# Altium schematic sheet power_stage.SchDoc
size Letter
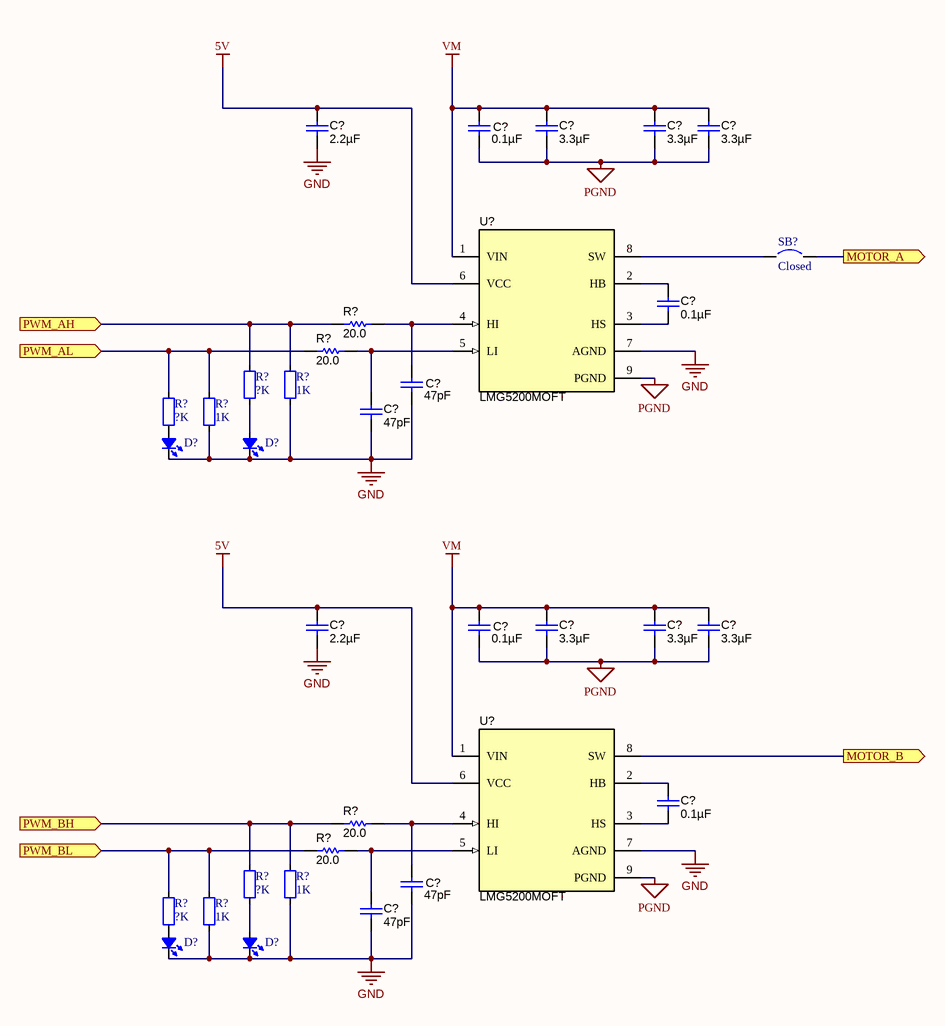
[diagram p0: power_stage.SchDoc]

## Parts
(Parts that share a designator on the sheet are numbered #1, #2 ... from top to bottom, then left to right.)
C?#1  ValueDisplayed: 0.1µF  [1206_190]  (hidden comment: C3216C0G2A104J160AC)
C?#2  ValueDisplayed: 2.2µF  [0402]  (hidden comment: C1005X5R1A225K050BC)
C?#3  ValueDisplayed: 3.3µF  [1206_190]  (hidden comment: C3216X7S2A335M160AB)
C?#4  ValueDisplayed: 3.3µF  [1206_190]  (hidden comment: C3216X7S2A335M160AB)
C?#5  ValueDisplayed: 3.3µF  [1206_190]  (hidden comment: C3216X7S2A335M160AB)
C?#6  ValueDisplayed: 0.1µF  [0402]  (hidden comment: GCM155R71C104KA55D)
C?#7  ValueDisplayed: 47pF  [0402]  (hidden comment: GRM1555C1E470JA01D)
C?#8  ValueDisplayed: 47pF  [0402]  (hidden comment: GRM1555C1E470JA01D)
C?#9  ValueDisplayed: 0.1µF  [1206_190]  (hidden comment: C3216C0G2A104J160AC)
C?#10  ValueDisplayed: 2.2µF  [0402]  (hidden comment: C1005X5R1A225K050BC)
C?#11  ValueDisplayed: 3.3µF  [1206_190]  (hidden comment: C3216X7S2A335M160AB)
C?#12  ValueDisplayed: 3.3µF  [1206_190]  (hidden comment: C3216X7S2A335M160AB)
C?#13  ValueDisplayed: 3.3µF  [1206_190]  (hidden comment: C3216X7S2A335M160AB)
C?#14  ValueDisplayed: 0.1µF  [0402]  (hidden comment: GCM155R71C104KA55D)
C?#15  ValueDisplayed: 47pF  [0402]  (hidden comment: GRM1555C1E470JA01D)
C?#16  ValueDisplayed: 47pF  [0402]  (hidden comment: GRM1555C1E470JA01D)
D?#1  LED_0402  [LED_0402_RED]  (value not drawn)
D?#2  LED_0402  [LED_0402_RED]  (value not drawn)
D?#3  LED_0402  [LED_0402_RED]  (value not drawn)
D?#4  LED_0402  [LED_0402_RED]  (value not drawn)
R?#1  ValueDisplayed: 20.0  [0402]  (hidden comment: CRCW040220R0FKED)
R?#2  ValueDisplayed: 20.0  [0402]  (hidden comment: CRCW040220R0FKED)
R?#3  value ?K  [RES_0402]  (hidden comment: Res_0402)
R?#4  value 1K  [RES_0805]  (hidden comment: Res_0805)
R?#5  value ?K  [RES_0402]  (hidden comment: Res_0402)
R?#6  value 1K  [RES_0805]  (hidden comment: Res_0805)
R?#7  ValueDisplayed: 20.0  [0402]  (hidden comment: CRCW040220R0FKED)
R?#8  ValueDisplayed: 20.0  [0402]  (hidden comment: CRCW040220R0FKED)
R?#9  value ?K  [RES_0402]  (hidden comment: Res_0402)
R?#10  value 1K  [RES_0805]  (hidden comment: Res_0805)
R?#11  value ?K  [RES_0402]  (hidden comment: Res_0402)
R?#12  value 1K  [RES_0805]  (hidden comment: Res_0805)
SB?  Closed  [SB_0603]
U?#1  LMG5200MOFT  [MOF0009A]
U?#2  LMG5200MOFT  [MOF0009A]

## Ports
MOTOR_A (out), MOTOR_B (out), PWM_AH (in), PWM_AL (in), PWM_BH (in), PWM_BL (in)

## Nets
5V: C?#2.1 C?#10.1 U?#1.6(VCC) U?#2.6(VCC)
GND: C?#2.2 C?#7.2 C?#8.2 C?#10.2 C?#15.2 C?#16.2 D?#1.2(K) D?#2.2(K) D?#3.2(K) D?#4.2(K) R?#4.1 R?#6.1 R?#10.1 R?#12.1 U?#1.7(AGND) U?#2.7(AGND)
PGND: C?#1.1 C?#3.2 C?#4.2 C?#5.2 C?#9.1 C?#11.2 C?#12.2 C?#13.2 U?#1.9(PGND) U?#2.9(PGND)
VM: C?#1.2 C?#3.1 C?#4.1 C?#5.1 C?#9.2 C?#11.1 C?#12.1 C?#13.1 U?#1.1(VIN) U?#2.1(VIN)
MOTOR_A: SB?.2 ; port MOTOR_A
MOTOR_B: U?#2.8(SW) ; port MOTOR_B
PWM_AH: R?#1.2 R?#3.2 R?#4.2 ; port PWM_AH
PWM_AL: R?#2.2 R?#5.2 R?#6.2 ; port PWM_AL
PWM_BH: R?#7.2 R?#9.2 R?#10.2 ; port PWM_BH
PWM_BL: R?#8.2 R?#11.2 R?#12.2 ; port PWM_BL
NetC?#6_1: C?#6.1 U?#1.2(HB)
NetC?#6_2: C?#6.2 U?#1.3(HS)
NetC?#7_1: C?#7.1 R?#1.1 U?#1.4(HI)
NetC?#8_1: C?#8.1 R?#2.1 U?#1.5(LI)
NetC?#14_1: C?#14.1 U?#2.2(HB)
NetC?#14_2: C?#14.2 U?#2.3(HS)
NetC?#15_1: C?#15.1 R?#7.1 U?#2.4(HI)
NetC?#16_1: C?#16.1 R?#8.1 U?#2.5(LI)
NetD?#1_1: D?#1.1(A) R?#5.1
NetD?#2_1: D?#2.1(A) R?#3.1
NetD?#3_1: D?#3.1(A) R?#11.1
NetD?#4_1: D?#4.1(A) R?#9.1
NetSB?_1: SB?.1 U?#1.8(SW)

## Library data of the parts
C?#1 C?#9 = C3216C0G2A104J160AC: CAP, CERM, 0.1 µF, 100 V, +/- 5%, C0G/NP0, 1206_190; Manufacturer: TDK; Polarized: N; CompType: Capacitor; Value: 0.1uF; U/M: EA; Cap_F: 0.0000001; Tolerance_%: 5; Value1: Unknown; VDC_V: 100; Value2: 100V; TaMin_C: -55; TaMax_C: 125; Cap_Case: 1206; SizeArea_mm2: 5.12; SizeAreaWB_mm2: 10.92; SizeX_mm: 3.2; SizeY_mm: 1.6; SizeZ_mm: 1.9; AEC Category: Q200; SymbolVersion: 2008-07-09; PartNumber: C3216C0G2A104J160AC; PackageReference: 1206_190; RoHS: Y; MountType: SMT; Technology: Ceramic; TempCo: C0G/NP0; Published: 2008-06-19; Publisher: Texas Instruments; LatestRevisionDate: 2016-07-21; ComponentLink1Description: Datasheet link; ComponentLink1URL: http://product.tdk.com/en/catalog/spec/mlccspec_commercial_general_midvoltage_en.pdf; Supplier 1: Digi-Key; Supplier Part Number 1: 445-172677-6-ND; Supplier 2: Mouser; Supplier Part Number 2: 810-C3216C0G2A104J6C; Supplier 3: Newark; Supplier Part Number 3: 39Y4271; AEC Qualified: N; AEC Grade: N/A
C?#2 C?#10 = C1005X5R1A225K050BC: CAP, CERM, 2.2 µF, 10 V, +/- 10%, X5R, 0402; Manufacturer: TDK; Polarized: N; CompType: Capacitor; Value: 2.2uF; U/M: EA; Cap_F: 0.0000022; Tolerance_%: 10; Value1: Unknown; Value2: 10V; TaMin_C: -55; TaMax_C: 85; SizeArea_mm2: 0.5; SizeAreaWB_mm2: 3; SizeX_mm: 1; SizeZ_mm: 0.6; AEC Category: Q200; SymbolVersion: 2008-07-09; PartNumber: C1005X5R1A225K050BC; PackageReference: 0402; RoHS: Y; VDC_V: 10; MountType: SMT; Technology: Ceramic; TempCo: X5R; Cap_Case: 0402; SizeY_mm: 0.5; Published: 2008-06-19; Publisher: Texas Instruments; LatestRevisionDate: 2016-06-02; ComponentLink1Description: Datasheet link; ComponentLink1URL: http://product.tdk.com/en/catalog/datasheets/mlcc_commercial_general_en.pdf; Supplier 1: Digi-Key; Supplier Part Number 1: 445-7392-1-ND; Supplier 2: Newark; Supplier Part Number 2: 87R3267; AEC Qualified: N; AEC Grade: N/A
C?#3-C?#5 C?#11-C?#13 = C3216X7S2A335M160AB: CAP, CERM, 3.3 µF, 100 V, +/- 20%, X7S, 1206_190; Manufacturer: TDK; Polarized: N; CompType: Capacitor; Value: 3.3uF; U/M: EA; Cap_F: 0.0000033; Tolerance_%: 20; ESR_ohm: 0.003048; Value1: 0.003048 ohm; VDC_V: 100; Value2: 100V; IRMS_A: 4.15703; TaMin_C: -55; TaMax_C: 125; AEC Category: Q200; SizeArea_mm2: 5.12; SizeAreaWB_mm2: 10.92; SizeX_mm: 3.2; SizeY_mm: 1.6; SizeZ_mm: 1.9; SymbolVersion: 2008-07-09; PartNumber: C3216X7S2A335M160AB; PackageReference: 1206_190; RoHS: Y; MountType: SMT; Technology: Ceramic; TempCo: X7S; Cap_Case: 1206_190; Published: 2008-06-19; Publisher: Texas Instruments; LatestRevisionDate: 2016-06-23; ComponentLink1Description: Datasheet link; ComponentLink1URL: https://product.tdk.com/en/search/capacitor/ceramic/mlcc/info?part_no=C3216X7S2A335M160AB; Supplier 1: Digi-Key; Supplier Part Number 1: 445-9234-1-ND; Supplier 2: Newark; Supplier Part Number 2: 46W3988; AEC Qualified: N; AEC Grade: N/A
C?#6 C?#14 = GCM155R71C104KA55D: CAP, CERM, 0.1 µF, 16 V, +/- 10%, X7R, 0402; Manufacturer: MuRata; Polarized: N; CompType: Capacitor; Value: 0.1uF; U/M: EA; Cap_F: 0.0000001; Tolerance_%: 10; Value1: Unknown; VDC_V: 16; Value2: 16V; TaMin_C: -55; TaMax_C: 125; AEC Category: Q200; SymbolVersion: 2008-07-09; PartNumber: GCM155R71C104KA55D; PackageReference: 0402; RoHS: Y; MountType: SMT; Technology: Ceramic; TempCo: X7R; Cap_Case: 0402; Published: 2008-06-19; Publisher: Texas Instruments; LatestRevisionDate: 2016-03-12; ComponentLink1Description: Datasheet link; ComponentLink1URL: http://psearch.murata.com/capacitor/product/GCM155R71C104KA55%23.pdf; Supplier 1: Digi-Key; Supplier Part Number 1: 490-4759-2-ND; AEC Qualified: ?
C?#7 C?#8 C?#15 C?#16 = GRM1555C1E470JA01D: CAP, CERM, 47 pF, 25 V, +/- 5%, C0G/NP0, 0402; Manufacturer: MuRata; Polarized: N; CompType: Capacitor; Value: 47pF; U/M: EA; Cap_F: 0.000000000047; Tolerance_%: 5; Value1: Unknown; VDC_V: 25; Value2: 25V; TaMin_C: -55; TaMax_C: 125; AEC Category: Q200; SymbolVersion: 2008-07-09; PartNumber: GRM1555C1E470JA01D; PackageReference: 0402; RoHS: Y; MountType: SMT; Technology: Ceramic; TempCo: C0G/NP0; Cap_Case: 0402; Published: 2008-06-19; Publisher: Texas Instruments; LatestRevisionDate: 2016-03-26; ComponentLink1Description: Datasheet link; ComponentLink1URL: http://search.murata.co.jp/Ceramy/PnsearchViewAction.do?HnOFG=ON&HnNFG=ON&SEL_CNT=50&sLang=en&sKey=GRM1555C1E470JA01D&x=9&y=9&search=startwith; Supplier 1: Mouser; Supplier Part Number 1: 81-GRM1555C1E470JA1D; AEC Qualified: ?
D?#1-D?#4 = LED_0402: LED
R?#1 R?#2 R?#7 R?#8 = CRCW040220R0FKED: RES, 20.0, 1%, 0.063 W, 0402; Manufacturer: Vishay-Dale; CompType: Resistor; Value: 20.0; Res_ohm: 20; Value_Code: 20R0; Tolerance_%: 1; Power_W: 0.063; Value2: 0.063W; VDC_V: 50; TempCo: 100 ppm/C; EIA_Code: E96; U/M: EA; AEC Category: Q200; SymbolVersion: 2009-05-29; PartNumber: CRCW040220R0FKED; PackageReference: 0402; RoHS: Y; Value1: 1%; MountType: SMT; Technology: Thick Film; Published: 2008-06-26; Publisher: Texas Instruments; LatestRevisionDate: 2016-03-18; ComponentLink1Description: Datasheet link; ComponentLink1URL: http://www.vishay.com/docs/20035/dcrcwe3.pdf; Supplier 1: Digi-Key; Supplier Part Number 1: 541-20.0LCT-ND; Supplier 2: Mouser; Supplier Part Number 2: 71-CRCW0402-20-E3; Supplier 3: Farnell; Supplier Part Number 3: 1652769; AEC Qualified: ?
R?#3 R?#5 R?#9 R?#11 = Res_0402: Resistor
R?#4 R?#6 R?#10 R?#12 = Res_0805: Resistor
SB? = Circuit Breaker_close: Circuit Breaker; Published: 24-Mar-1999; Revision: July-2002: Re-released for DXP Platform.; Publisher: Altium Limited
U?#1 U?#2 = PLMG5200MOFT: 100V GaN Half Bridge Power Module, MOF0009A; Manufacturer: Texas Instruments; SymbolCreator: Altium; CompType: IC; U/M: EA; SymbolVersion: 2016-3-1; PartNumber: LMG5200MOFT; PackageReference: MOF0009A; MountType: SMT; ComponentLink1Description: Datasheet Link; ComponentLink1URL: http://www.ti.com/lit/ds/symlink/lmg5200.pdf; RoHS: Y; Publisher: Texas Instruments; LatestRevisionDate: 2016-03-14; Alternate Manufacturer: Texas Instruments